# Altium schematic sheet 2-MCP23S17.SchDoc
size A4
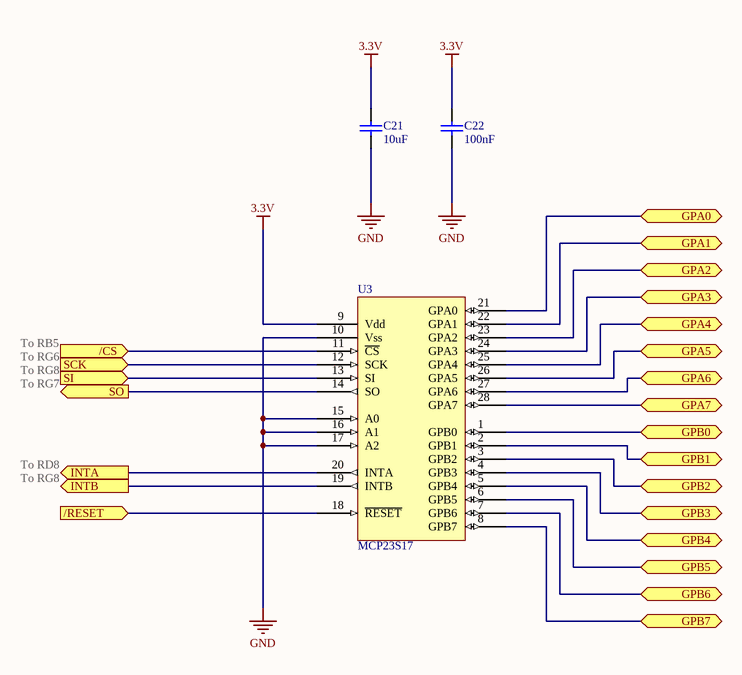
[diagram p0: 2-MCP23S17.SchDoc]

## Parts
C21  10uF  [capa 1206]
C22  100nF  [capa 1206]
U3  MCP23S17  [MCP23S17-E/SO]

## Ports
/CS (in), /RESET (in), GPA0 (bidir), GPA1 (bidir), GPA2 (bidir), GPA3 (bidir), GPA4 (bidir), GPA5 (bidir), GPA6 (bidir), GPA7 (bidir), GPB0 (bidir), GPB1 (bidir), GPB2 (bidir), GPB3 (bidir), GPB4 (bidir), GPB5 (bidir), GPB6 (bidir), GPB7 (bidir), INTA (out), INTB (out), SCK (in), SI (in), SO (out)

## Nets
3.3V: C21.1 C22.1 U3.9(Vdd)
GND: C21.2 C22.2 U3.10(Vss) U3.15(A0) U3.16(A1) U3.17(A2)
/CS: U3.11(~{CS}) ; port /CS
/RESET: U3.18(~{RESET}) ; port /RESET
GPA0: U3.21(GPA0) ; port GPA0
GPA1: U3.22(GPA1) ; port GPA1
GPA2: U3.23(GPA2) ; port GPA2
GPA3: U3.24(GPA3) ; port GPA3
GPA4: U3.25(GPA4) ; port GPA4
GPA5: U3.26(GPA5) ; port GPA5
GPA6: U3.27(GPA6) ; port GPA6
GPA7: U3.28(GPA7) ; port GPA7
GPB0: U3.1(GPB0) ; port GPB0
GPB1: U3.2(GPB1) ; port GPB1
GPB2: U3.3(GPB2) ; port GPB2
GPB3: U3.4(GPB3) ; port GPB3
GPB4: U3.5(GPB4) ; port GPB4
GPB5: U3.6(GPB5) ; port GPB5
GPB6: U3.7(GPB6) ; port GPB6
GPB7: U3.8(GPB7) ; port GPB7
INTA: U3.20(INTA) ; port INTA
INTB: U3.19(INTB) ; port INTB
SCK: U3.12(SCK) ; port SCK
SI: U3.13(SI) ; port SI
SO: U3.14(SO) ; port SO

## Notes on the sheet
- To RB5
- To RG6
- To RG8
- To RG7
- To RD8

## Library data of the parts
C21 = Cap: Capacitor; Fabricant: MULTICOMP; Fournisseur: Farnell; RefFabricant: MC1206X106K160CT; RefFournisseur: 2320922
C22 = Cap: Capacitor; Fabricant: MULTICOMP; Fournisseur: Farnell; RefFabricant: MC1206B104K500CT; RefFournisseur: 1759361
U3 = MCP23S17: Fabricant: Microchip; Fournisseur: Farnell; RefFournisseur: 1332093; RefFabricant: MCP23S17-E/SO